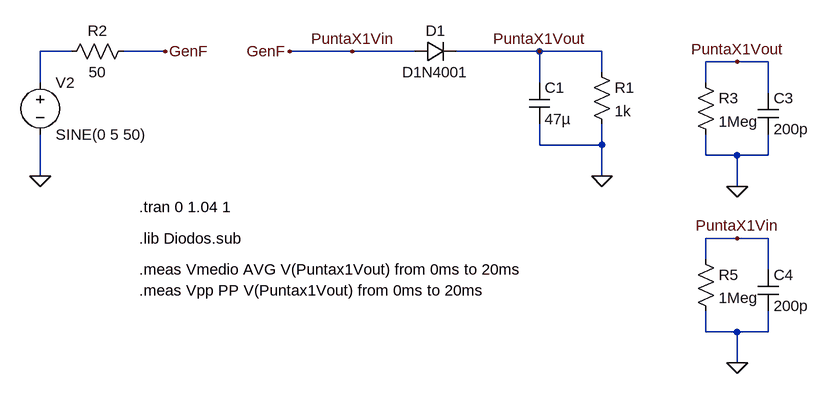
[diagram p0: schematic F1_vo_RL-1k.asc]
F1_vo_RL-1k.asc, the LTspice schematic file:
Version 4
SHEET 1 984 804
WIRE -384 64 -432 64
WIRE -240 64 -304 64
WIRE 48 64 -48 64
WIRE 144 64 48 64
WIRE 336 64 208 64
WIRE 432 64 336 64
WIRE 640 80 592 80
WIRE 688 80 640 80
WIRE 432 96 432 64
WIRE -432 112 -432 64
WIRE 336 112 336 64
WIRE 592 112 592 80
WIRE 688 128 688 80
WIRE 336 208 336 176
WIRE 432 208 432 176
WIRE 432 208 336 208
WIRE 592 224 592 192
WIRE 640 224 592 224
WIRE 688 224 688 192
WIRE 688 224 640 224
WIRE -432 256 -432 192
WIRE 432 256 432 208
WIRE 640 272 640 224
WIRE 640 352 592 352
WIRE 688 352 640 352
WIRE 592 384 592 352
WIRE 688 400 688 352
WIRE 592 496 592 464
WIRE 640 496 592 496
WIRE 688 496 688 464
WIRE 688 496 640 496
WIRE 640 544 640 496
FLAG 432 256 0
FLAG -432 256 0
FLAG -240 64 GenF
FLAG -48 64 GenF
FLAG 336 64 PuntaX1Vout
FLAG 640 272 0
FLAG 640 80 PuntaX1Vout
FLAG 640 544 0
FLAG 640 352 PuntaX1Vin
FLAG 48 64 PuntaX1Vin
SYMBOL diode 144 80 R270
WINDOW 0 32 32 VTop 2
WINDOW 3 0 32 VBottom 2
SYMATTR InstName D1
SYMATTR Value D1N4001
SYMBOL res 416 80 R0
SYMATTR InstName R1
SYMATTR Value 1k
SYMBOL voltage -432 96 R0
WINDOW 123 0 0 Left 2
WINDOW 39 0 0 Left 2
SYMATTR InstName V2
SYMATTR Value SINE(0 5 50)
SYMBOL res -400 80 R270
WINDOW 0 32 56 VTop 2
WINDOW 3 0 56 VBottom 2
SYMATTR InstName R2
SYMATTR Value 50
SYMBOL cap 320 112 R0
SYMATTR InstName C1
SYMATTR Value 47µ
SYMBOL res 576 96 R0
SYMATTR InstName R3
SYMATTR Value 1Meg
SYMBOL cap 672 128 R0
SYMATTR InstName C3
SYMATTR Value 200p
SYMBOL res 576 368 R0
SYMATTR InstName R5
SYMATTR Value 1Meg
SYMBOL cap 672 400 R0
SYMATTR InstName C4
SYMATTR Value 200p
TEXT -280 352 Left 2 !.lib Diodos.sub
TEXT -280 304 Left 2 !.tran 0 1.04 1
TEXT -280 400 Left 2 !.meas Vmedio AVG V(Puntax1Vout) from 0ms to 20ms
TEXT -280 432 Left 2 !.meas Vpp PP V(Puntax1Vout) from 0ms to 20ms

The netlist it stands for:
* F1_vo_RL-1k.asc
D1 PuntaX1Vin PuntaX1Vout D1N4001
R1 PuntaX1Vout 0 1k
V2 N001 0 SINE(0 5 50)
R2 N001 PuntaX1Vin 50
C1 PuntaX1Vout 0 47µ
R3 PuntaX1Vout 0 1Meg
C3 PuntaX1Vout 0 200p
R5 PuntaX1Vin 0 1Meg
C4 PuntaX1Vin 0 200p
.model D D
.lib standard.dio
.lib Diodos.sub
.tran 0 1.04 1
.meas Vmedio AVG V(Puntax1Vout) from 0ms to 20ms
.meas Vpp PP V(Puntax1Vout) from 0ms to 20ms
.backanno
.end